# EAGLE design R122C (EAGLE 6.6.0)
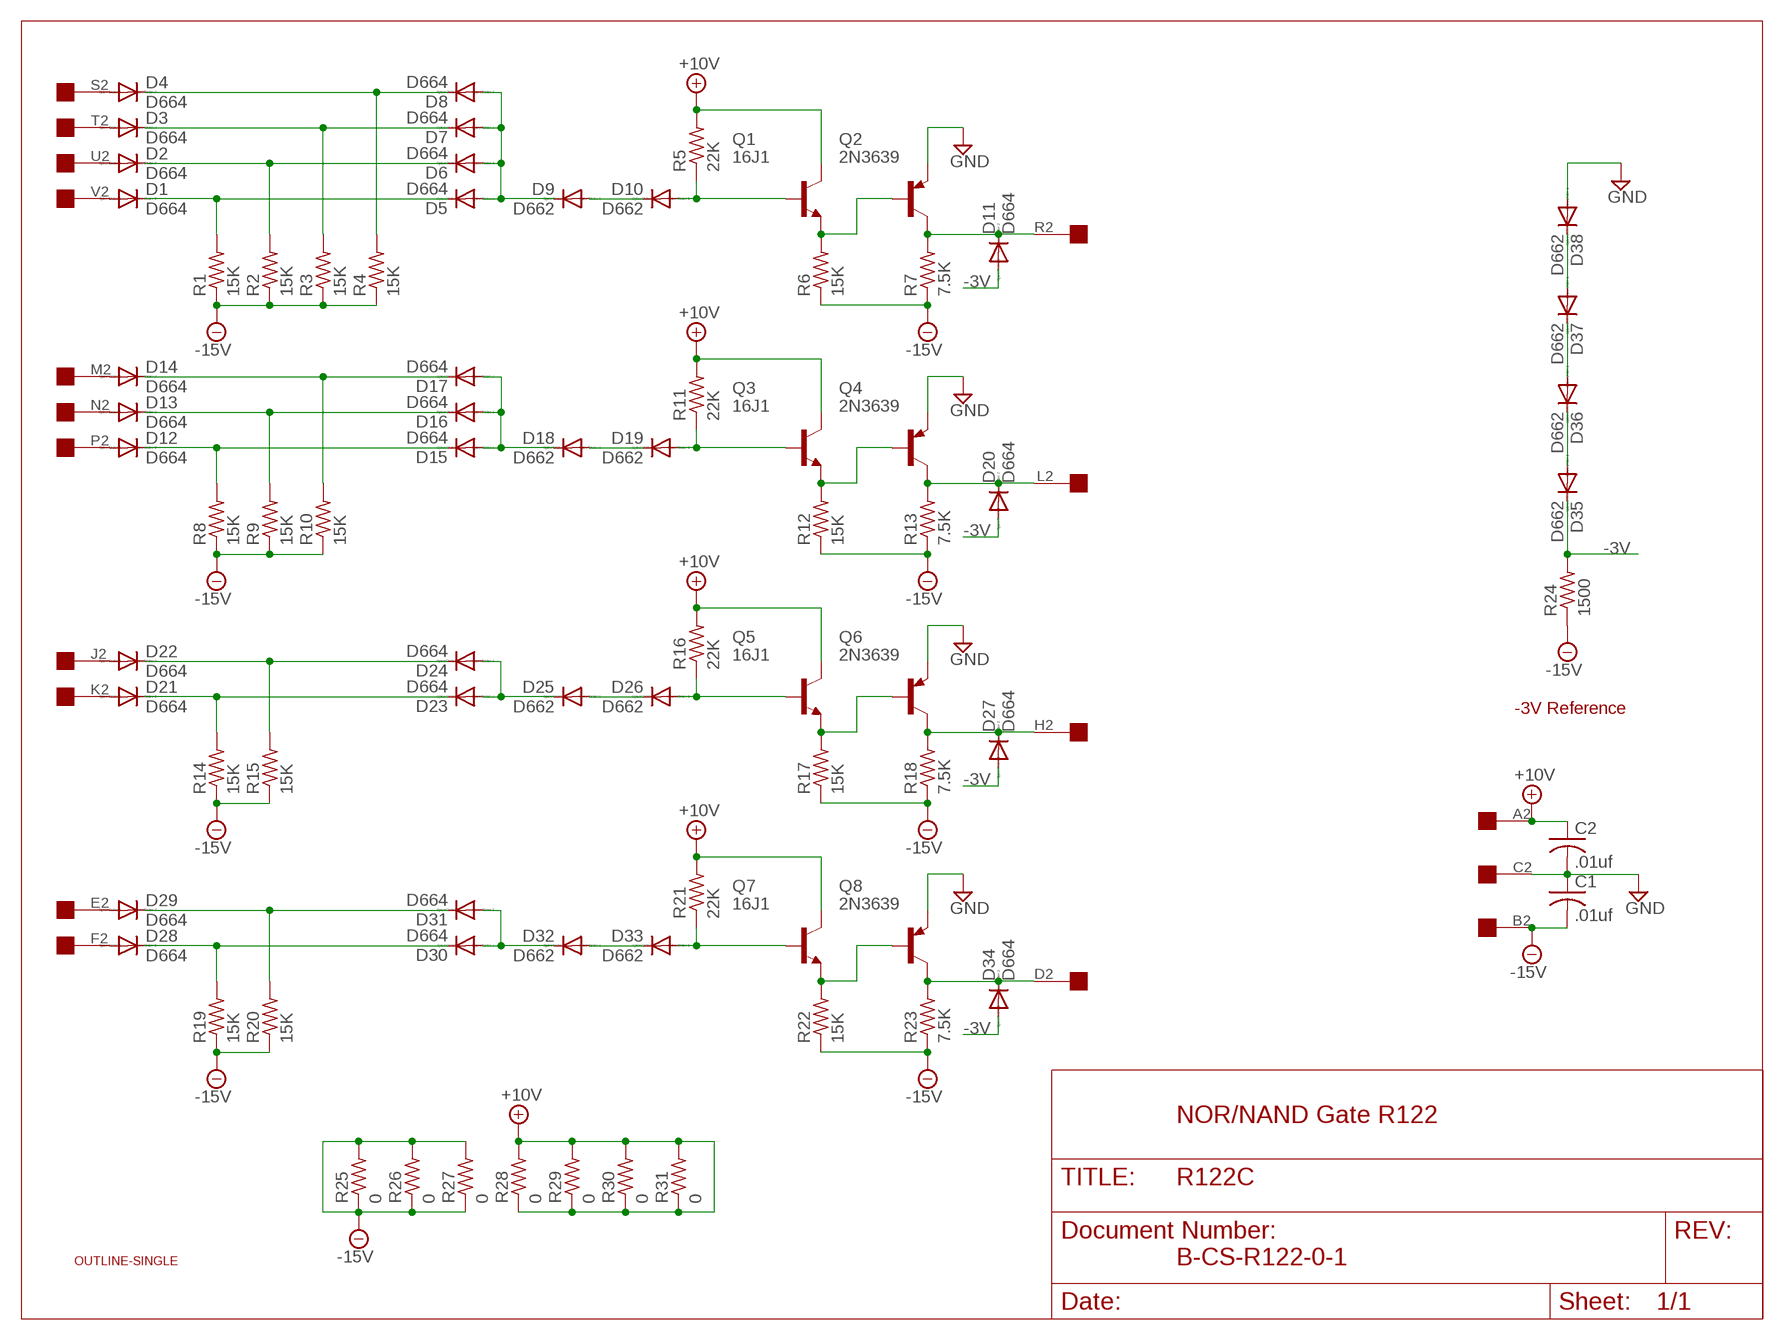
[diagram p0: schematic, sheet 1]

## Parts
C1  .01uf  C-US  [C063-025X075]
C2  .01uf  C-US  [C063-025X075]
D1  D664  1N4148DO35-10  [DO35-10]
D2  D664  1N4148DO35-10  [DO35-10]
D3  D664  1N4148DO35-10  [DO35-10]
D4  D664  1N4148DO35-10  [DO35-10]
D5  D664  1N4148DO35-10  [DO35-10]
D6  D664  1N4148DO35-10  [DO35-10]
D7  D664  1N4148DO35-10  [DO35-10]
D8  D664  1N4148DO35-10  [DO35-10]
D9  D662  1N4148DO35-10  [DO35-10]
D10  D662  1N4148DO35-10  [DO35-10]
D11  D664  1N4148DO35-10  [DO35-10]
D12  D664  1N4148DO35-10  [DO35-10]
D13  D664  1N4148DO35-10  [DO35-10]
D14  D664  1N4148DO35-10  [DO35-10]
D15  D664  1N4148DO35-10  [DO35-10]
D16  D664  1N4148DO35-10  [DO35-10]
D17  D664  1N4148DO35-10  [DO35-10]
D18  D662  1N4148DO35-10  [DO35-10]
D19  D662  1N4148DO35-10  [DO35-10]
D20  D664  1N4148DO35-10  [DO35-10]
D21  D664  1N4148DO35-10  [DO35-10]
D22  D664  1N4148DO35-10  [DO35-10]
D23  D664  1N4148DO35-10  [DO35-10]
D24  D664  1N4148DO35-10  [DO35-10]
D25  D662  1N4148DO35-10  [DO35-10]
D26  D662  1N4148DO35-10  [DO35-10]
D27  D664  1N4148DO35-10  [DO35-10]
D28  D664  1N4148DO35-10  [DO35-10]
D29  D664  1N4148DO35-10  [DO35-10]
D30  D664  1N4148DO35-10  [DO35-10]
D31  D664  1N4148DO35-10  [DO35-10]
D32  D662  1N4148DO35-10  [DO35-10]
D33  D662  1N4148DO35-10  [DO35-10]
D34  D664  1N4148DO35-10  [DO35-10]
D35  D662  1N4148DO35-10  [DO35-10]
D36  D662  1N4148DO35-10  [DO35-10]
D37  D662  1N4148DO35-10  [DO35-10]
D38  D662  1N4148DO35-10  [DO35-10]
Q1  16J1  2N1711-NPN-TO39-EBC  [TO39]
Q2  2N3639  2N3637  [TO39]
Q3  16J1  2N1711-NPN-TO39-EBC  [TO39]
Q4  2N3639  2N3637  [TO39]
Q5  16J1  2N1711-NPN-TO39-EBC  [TO39]
Q6  2N3639  2N3637  [TO39]
Q7  16J1  2N1711-NPN-TO39-EBC  [TO39]
Q8  2N3639  2N3637  [TO39]
R1  15K  R-US_0207/10  [0207/10]
R2  15K  R-US_0207/10  [0207/10]
R3  15K  R-US_0207/10  [0207/10]
R4  15K  R-US_0207/10  [0207/10]
R5  22K  R-US_0207/10  [0207/10]
R6  15K  R-US_0207/10  [0207/10]
R7  7.5K  R-US_0207/10  [0207/10]
R8  15K  R-US_0207/10  [0207/10]
R9  15K  R-US_0207/10  [0207/10]
R10  15K  R-US_0207/10  [0207/10]
R11  22K  R-US_0207/10  [0207/10]
R12  15K  R-US_0207/10  [0207/10]
R13  7.5K  R-US_0207/10  [0207/10]
R14  15K  R-US_0207/10  [0207/10]
R15  15K  R-US_0207/10  [0207/10]
R16  22K  R-US_0207/10  [0207/10]
R17  15K  R-US_0207/10  [0207/10]
R18  7.5K  R-US_0207/10  [0207/10]
R19  15K  R-US_0207/10  [0207/10]
R20  15K  R-US_0207/10  [0207/10]
R21  22K  R-US_0207/10  [0207/10]
R22  15K  R-US_0207/10  [0207/10]
R23  7.5K  R-US_0207/10  [0207/10]
R24  1500  R-US_0207/10  [0207/10]
R25  0  R-US_0207/10  [0207/10]
R26  0  R-US_0207/10  [0207/10]
R27  0  R-US_0207/10  [0207/10]
R28  0  R-US_0207/10  [0207/10]
R29  0  R-US_0207/10  [0207/10]
R30  0  R-US_0207/10  [0207/10]
R31  0  R-US_0207/10  [0207/10]
U$1  OUTLINE-SINGLE  [SINGLE]
U$2  EDGE-1  [EDGE-CON1]

## Nets
+10V [Power]: C2.1 Q1.3(C) Q3.3(C) Q5.3(C) Q7.3(C) R5.2 R11.2 R16.2 R21.2 R28.1 R28.2 R29.1 R29.2 R30.1 R30.2 R31.1 R31.2 U$2.A2
-3V [Power]: D11.A D20.A D27.A D34.A D35.C R24.2
-15V [Power]: C1.2 R1.1 R2.1 R3.1 R4.1 R6.1 R7.1 R8.1 R9.1 R10.1 R12.1 R13.1 R14.1 R15.1 R17.1 R18.1 R19.1 R20.1 R22.1 R23.1 R24.1 R25.1 R25.2 R26.1 R26.2 R27.1 R27.2 U$2.B2
GND [Power]: C1.1 C2.2 D38.A Q2.1(E) Q4.1(E) Q6.1(E) Q8.1(E) U$2.C2
N$1: D19.A Q3.2(B) R11.1
N$2: D14.A U$2.M2
N$3: D37.A D38.C
N$4: D12.C D15.C R8.2
N$5: D11.C Q2.3(C) R7.2 U$2.R2
N$6: D18.A D19.C
N$7: D13.A U$2.N2
N$8: D20.C Q4.3(C) R13.2 U$2.L2
N$9: D12.A U$2.P2
N$10: D21.A U$2.K2
N$11: D15.A D16.A D17.A D18.C
N$12: D22.A U$2.J2
N$13: D36.A D37.C
N$14: D14.C D17.C R10.2
N$15: D13.C D16.C R9.2
N$16: D35.A D36.C
N$17: Q3.1(E) Q4.2(B) R12.2
N$18: D26.A Q5.2(B) R16.1
N$19: D10.A Q1.2(B) R5.1
N$20: D4.A U$2.S2
N$21: D1.A U$2.V2
N$22: D1.C D5.C R1.2
N$23: D9.A D10.C
N$24: D28.A U$2.F2
N$25: D3.A U$2.T2
N$26: D21.C D23.C R14.2
N$27: D25.A D26.C
N$28: D29.A U$2.E2
N$29: D5.A D6.A D7.A D8.A D9.C
N$30: D4.C D8.C R4.2
N$31: D27.C Q6.3(C) R18.2 U$2.H2
N$32: D3.C D7.C R3.2
N$33: D2.C D6.C R2.2
N$34: Q1.1(E) Q2.2(B) R6.2
N$37: D23.A D24.A D25.C
N$39: D2.A U$2.U2
N$41: D22.C D24.C R15.2
N$42: Q5.1(E) Q6.2(B) R17.2
N$43: D33.A Q7.2(B) R21.1
N$45: D28.C D30.C R19.2
N$46: D32.A D33.C
N$48: D34.C Q8.3(C) R23.2 U$2.D2
N$51: D30.A D31.A D32.C
N$54: D29.C D31.C R20.2
N$55: Q7.1(E) Q8.2(B) R22.2

## Notes on the sheet
- -3V Reference
- NOR/NAND Gate R122
- B-CS-R122-0-1

## Library data of the parts
C1 C2 = dec-con:C-US: Capacitors with funky DEC lead spacing.
D1-D38 = diode:1N4148: DIODE high speed (Philips)
Q1 Q3 Q5 Q7 = transistor:*-NPN-: NPN Transistror BF959 corrected 2008.03.06
Q2 Q4 Q6 Q8 = transistor-pnp:2N3637*: PNP Transistror
R1-R31 = rcl:R-US_: RESISTOR, American symbol
U$1 = dec-con:OUTLINE-*: Board outlines for DEC boards.
U$2 = dec-con:EDGE-1: Single-Sided DEC Edge Connector -- (side 2)

## Net classes
1 Power: width 0.813 mm

## Board
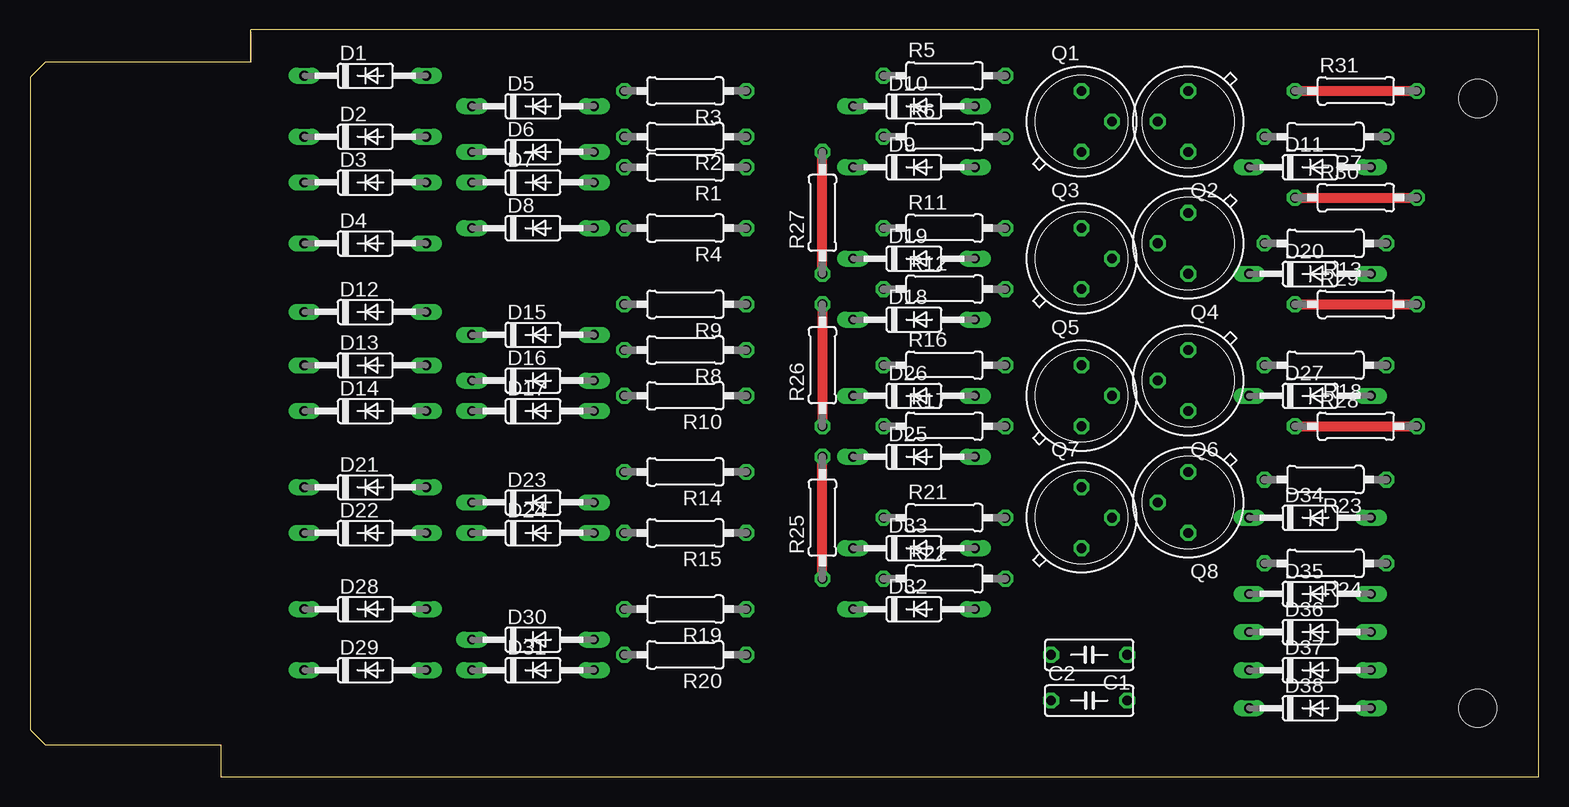
[diagram p1: board, top side]
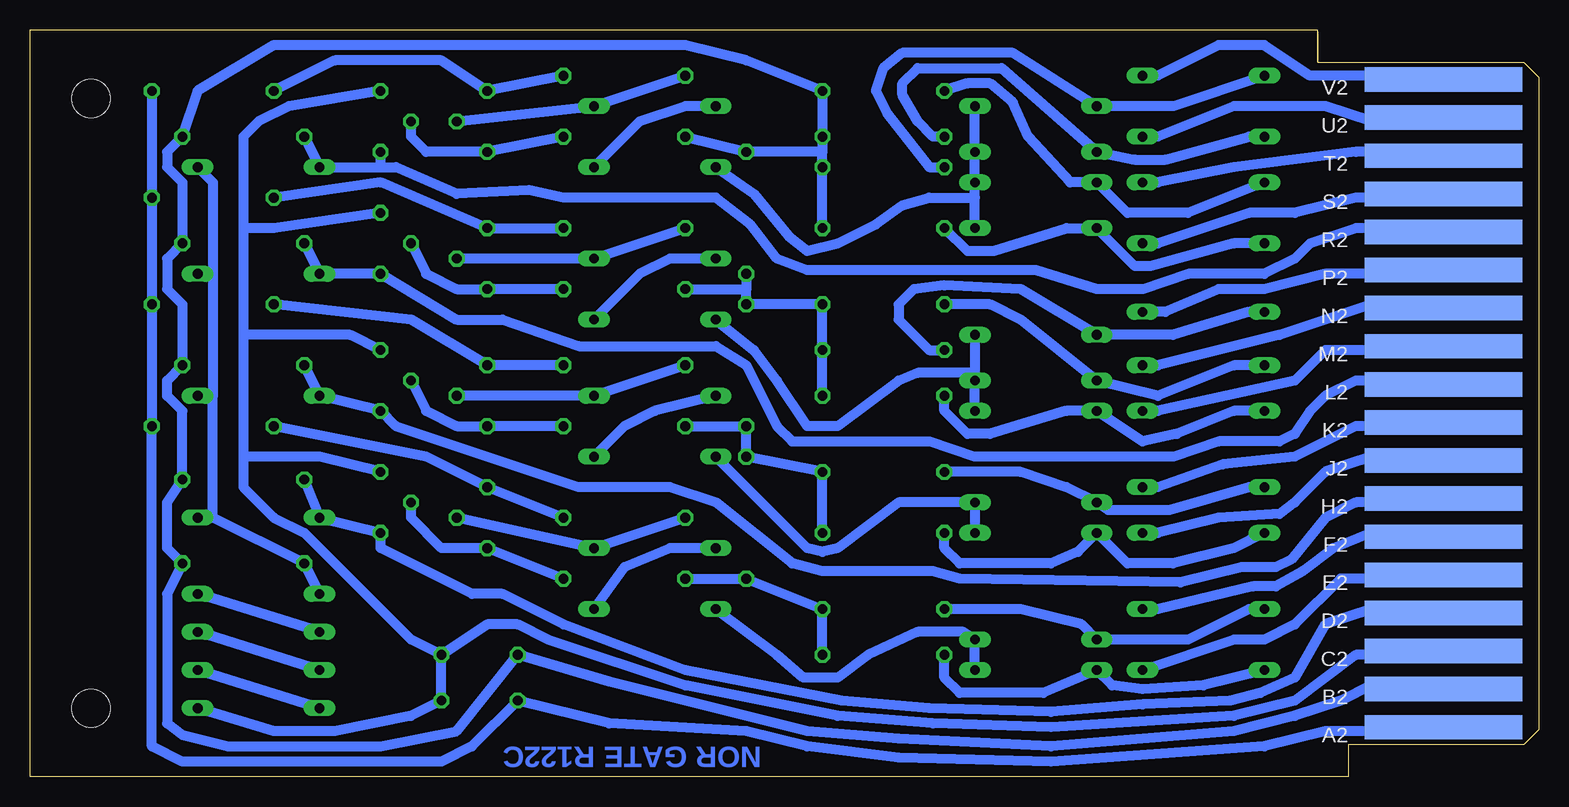
[diagram p2: board, bottom side, seen from below]

Size 125.73 x 62.23 mm. Coordinates in mm from the lower left corner, seen from the top.
Copper layers (1+16): Top 0.035mm / dielectric 1.5mm / Bottom 0.035mm
Design rules "16mils": minimum track width 16mil, minimum drill 32mil, track to track 15mil, track to pad 10mil, pad to pad 10mil, via to via 10mil, smd to smd 10mil, copper to edge 13mil, drill to drill 10mil, minimum pad ring 10mil, minimum via ring 8mil, stop-mask expansion 0mil, vias tented up to drill 0mil, thermal gap 10mil

### Footprints (pad centres in the part's own frame; a part is rotated, then mirrored left to right if it is on the bottom)
C063-025X075 = drill 0.813 octagon: 1 -2.54,0; 2 3.81,0
DO35-10 = drill 0.813 long: A 5.08,0; C -5.08,0
TO39 = drill 0.813 octagon: 1 0,-2.54; 2 2.54,0; 3 0,2.54
0207/10 = drill 0.813 octagon: 1 -5.08,0; 2 5.08,0
SINGLE = hole 3.175: 120.65,56.515; 120.65,5.715
EDGE-CON1 = smd 13.106 x 2.032 bottom: A2 7.938,4.128; B2 7.938,7.303; C2 7.938,10.477; D2 7.938,13.652; E2 7.938,16.828; F2 7.938,20.003; H2 7.938,23.177; J2 7.938,26.352; K2 7.938,29.527; L2 7.938,32.703; M2 7.938,35.877; N2 7.938,39.053; P2 7.938,42.227; R2 7.938,45.403; S2 7.938,48.578; T2 7.938,51.752; U2 7.938,54.928; V2 7.938,58.102

### Placement (x,y rotation side)
C1  88.9,10.16 180 top
C2  87.63,6.35 0 top
D1  27.94,58.42 0 top
D2  27.94,53.34 0 top
D3  27.94,49.53 0 top
D4  27.94,44.45 0 top
D5  41.91,55.88 0 top
D6  41.91,52.07 0 top
D7  41.91,49.53 0 top
D8  41.91,45.72 0 top
D9  73.66,50.8 0 top
D10  73.66,55.88 0 top
D11  106.68,50.8 0 top
D12  27.94,38.73 0 top
D13  27.94,34.29 0 top
D14  27.94,30.48 0 top
D15  41.91,36.83 0 top
D16  41.91,33.02 0 top
D17  41.91,30.48 0 top
D18  73.66,38.1 0 top
D19  73.66,43.18 0 top
D20  106.68,41.91 0 top
D21  27.94,24.13 0 top
D22  27.94,20.32 0 top
D23  41.91,22.86 0 top
D24  41.91,20.32 0 top
D25  73.66,26.67 0 top
D26  73.66,31.75 0 top
D27  106.68,31.75 0 top
D28  27.94,13.97 0 top
D29  27.94,8.89 0 top
D30  41.91,11.43 0 top
D31  41.91,8.89 0 top
D32  73.66,13.97 0 top
D33  73.66,19.05 0 top
D34  106.68,21.59 0 top
D35  106.68,15.24 0 top
D36  106.68,12.06 0 top
D37  106.68,8.89 0 top
D38  106.68,5.71 0 top
Q1  87.63,54.61 0 top
Q2  96.52,54.61 180 top
Q3  87.63,43.18 0 top
Q4  96.52,44.45 180 top
Q5  87.63,31.75 0 top
Q6  96.52,33.02 180 top
Q7  87.63,21.59 0 top
Q8  96.52,22.86 180 top
R1  54.61,50.8 180 top
R2  54.61,53.34 180 top
R3  54.61,57.15 180 top
R4  54.61,45.72 180 top
R5  76.2,58.42 0 top
R6  76.2,53.34 0 top
R7  107.95,53.34 180 top
R8  54.61,35.56 180 top
R9  54.61,39.37 180 top
R10  54.61,31.75 180 top
R11  76.2,45.72 0 top
R12  76.2,40.64 0 top
R13  107.95,44.45 180 top
R14  54.61,25.4 180 top
R15  54.61,20.32 180 top
R16  76.2,34.29 0 top
R17  76.2,29.21 0 top
R18  107.95,34.29 180 top
R19  54.61,13.97 180 top
R20  54.61,10.16 180 top
R21  76.2,21.59 0 top
R22  76.2,16.51 0 top
R23  107.95,24.77 180 top
R24  107.95,17.78 180 top
R25  66.04,21.59 90 top
R26  66.04,34.29 90 top
R27  66.04,46.99 90 top
R28  110.49,29.21 0 top
R29  110.49,39.37 0 top
R30  110.49,48.26 0 top
R31  110.49,57.15 0 top
U$1  0,0 0 top
U$2  0,0 0 top

### Tracks (layer width: path | path; a pad name or v marks a point on that pad's centre or on a via)
+10V
  Top 0.813: R31.1 R31.2 | R30.1 R30.2 | R28.1 R28.2 | R29.1 R29.2
  Bottom 0.813: U$2.A2 8.89,4.13 8.89,3.81 17.78,3.81 22.86,2.54 40.64,1.27 53.34,1.59 60.96,2.54 66.04,3.81 77.47,4.45 C2.1 88.9,2.54 91.44,1.27 113.03,1.27 115.57,2.54 R28.2 R29.2 R30.2 R31.2 | R5.2 Q1.3 91.44,59.69 100.33,59.69 R31.1 | R21.2 Q7.3 92.71,26.67 R28.1 | R16.2 Q5.3 93.98,38.1 R29.1 | R30.1 96.52,49.53 Q3.3 R11.2
-3V
  Bottom 0.813: D35.C R24.2 110.49,21.59 | D34.A 110.49,21.59 | 110.49,21.59 110.49,31.75 | D27.A 110.49,31.75 | D20.A 110.49,41.91 | 110.49,41.91 110.49,31.75 | D11.A 110.49,49.53 110.49,41.91
-15V
  Top 0.813: R27.1 R27.2 | R26.2 R26.1 | R25.1 R25.2
  Bottom 0.813: U$2.B2 8.89,7.62 13.97,7.62 16.51,6.35 20.32,5.08 25.4,3.81 40.64,2.54 53.34,3.17 60.96,3.81 77.47,7.94 C1.2 90.17,3.81 96.52,2.54 109.22,2.54 113.03,3.49 114.3,4.45 114.3,15.24 R24.1 114.3,19.05 114.3,22.86 R23.1 113.03,30.48 114.3,31.75 114.3,33.02 R18.1 113.03,39.37 114.3,40.64 114.3,43.18 R13.1 113.03,49.53 114.3,50.8 114.3,52.07 R7.1 111.76,57.15 105.41,60.96 71.12,60.96 66.04,59.69 R3.1 R2.1 59.69,52.07 | R10.1 R8.1 R9.1 R26.2 66.04,40.64 | R15.1 R14.1 R25.2 R26.1 R17.1 | R20.1 R19.1 R25.1 R22.1 | 59.69,52.07 R1.1 R4.1 | R27.1 66.04,40.64 | R12.1 66.04,40.64 | 59.69,52.07 R27.2 R6.1
GND
  Bottom 0.813: U$2.C2 8.89,10.16 15.24,10.16 20.32,6.35 25.4,5.08 40.64,4.13 50.48,4.45 58.42,5.08 71.12,7.62 82.55,11.43 85.09,12.7 87.63,12.7 C1.1 | C1.1 C2.2 93.98,5.08 100.33,3.81 105.41,3.81 D38.A | C1.1 93.98,11.43 102.87,20.32 105.41,21.59 107.95,24.13 107.95,26.67 | Q8.1 101.6,26.67 107.95,26.67 | Q2.1 104.14,55.88 106.68,54.61 107.95,53.34 107.95,45.72 | 107.95,45.72 107.95,36.83 | 107.95,36.83 107.95,26.67 | Q6.1 99.06,36.83 107.95,36.83 | Q4.1 105.41,45.72 107.95,45.72
N$1
  Bottom 0.813: R11.1 D19.A Q3.2
N$2
  Bottom 0.813: U$2.M2 8.89,35.56 17.78,35.56 20.32,33.02 31.75,30.48 D14.A
N$3
  Bottom 0.813: D38.C D37.A
N$4
  Bottom 0.813: D12.C 24.13,38.73 30.48,36.83 D15.C 43.18,40.64 49.53,40.96 52.07,40.64 53.34,39.37 53.34,38.1 50.8,35.56 R8.2
N$5
  Bottom 0.813: U$2.R2 8.89,45.72 15.24,45.72 19.05,44.45 20.32,43.18 22.86,41.91 29.21,41.91 33.02,40.64 36.83,40.64 41.91,42.23 60.96,42.23 63.5,43.18 65.72,46.04 68.58,48.26 81.28,48.26 84.14,48.9 90.17,48.58 95.25,50.8 96.52,50.8 | 96.52,50.8 Q2.3 | 96.52,50.8 D11.C R7.2
N$6
  Bottom 0.813: D19.C 72.39,43.18 74.93,41.91 D18.A
N$7
  Bottom 0.813: U$2.N2 8.89,39.37 13.97,39.37 21.59,36.83 31.75,34.29 D13.A
N$8
  Bottom 0.813: U$2.L2 8.89,33.02 15.24,33.02 17.78,31.75 19.05,30.48 20.32,28.57 21.59,27.94 26.67,27.94 30.48,26.67 46.99,26.67 50.8,27.94 62.23,27.94 63.5,29.21 66.04,34.29 68.58,35.88 80.01,35.88 86.36,38.1 90.17,38.1 Q4.3 D20.C R13.2
N$9
  Bottom 0.813: U$2.P2 8.89,41.91 17.78,41.91 22.86,40.64 26.67,40.64 31.12,38.73 D12.A
N$10
  Bottom 0.813: U$2.K2 8.89,29.21 15.24,29.21 20.32,26.67 26.35,26.04 31.75,24.13 D21.A
N$11
  Bottom 0.813: D15.A 46.99,33.66 | 46.99,33.66 D16.A D17.A | 46.99,33.66 51.75,33.66 53.34,33.02 58.42,29.21 60.96,29.21 63.5,33.02 65.41,35.56 D18.C
N$12
  Bottom 0.813: U$2.J2 10.16,26.67 13.97,26.67 17.78,25.4 20.32,22.86 21.59,21.91 26.67,21.59 31.75,20.32 D22.A
N$13
  Bottom 0.813: D37.C D36.A
N$14
  Bottom 0.813: D14.C 25.4,30.48 30.16,28.57 33.02,27.94 D17.C 39.37,30.48 45.72,28.57 47.63,28.57 49.53,30.48 R10.2
N$15
  Bottom 0.813: D13.C 25.4,34.29 31.75,31.75 D16.C 43.18,38.1 45.72,39.37 R9.2
N$16
  Bottom 0.813: D36.C D35.A
N$17
  Bottom 0.813: R12.2 Q3.1 90.17,40.64 92.71,41.91 Q4.2
N$18
  Bottom 0.813: R16.1 D26.A Q5.2
N$19
  Bottom 0.813: R5.1 D10.A Q1.2
N$20
  Bottom 0.813: U$2.S2 8.89,48.26 15.24,48.26 20.32,46.99 24.13,46.99 31.75,44.45 D4.A
N$21
  Bottom 0.813: U$2.V2 10.16,58.42 19.05,58.42 22.86,60.96 26.67,60.96 31.75,58.42 D1.A
N$22
  Bottom 0.813: D1.C 30.48,55.88 D5.C 43.82,60.33 53.02,60.33 54.61,59.05 55.25,57.15 54.29,55.24 50.8,50.8 R1.2
N$23
  Bottom 0.813: D10.C 71.12,55.88 74.93,54.61 D9.A
N$24
  Bottom 0.813: U$2.F2 7.62,20.32 13.97,20.32 17.15,19.05 19.69,17.14 21.91,15.88 23.81,15.88 31.75,13.97 D28.A
N$25
  Bottom 0.813: U$2.T2 8.89,52.07 15.24,52.07 25.4,50.8 31.75,49.53 D3.A
N$26
  Bottom 0.813: D21.C 24.13,24.13 30.8,22.23 35.88,22.23 D23.C 39.37,24.13 43.18,25.4 R14.2
N$27
  Bottom 0.813: D26.C 73.66,30.48 76.2,29.21 D25.A
N$28
  Bottom 0.813: U$2.E2 8.89,16.51 16.51,16.51 20.32,12.7 22.86,11.43 25.4,11.43 D29.A
N$29
  Bottom 0.813: D8.A 46.99,48.26 | 46.99,48.26 D7.A D6.A D5.A | D9.C 65.41,48.58 62.55,45.09 60.96,43.81 58.42,44.45 55.25,46.04 53.02,47.62 50.8,48.26 46.99,48.26
N$30
  Bottom 0.813: D4.C 25.4,44.45 32.39,42.55 33.66,42.55 D8.C 39.37,45.72 45.4,43.81 47.63,43.81 R4.2
N$31
  Bottom 0.813: U$2.H2 8.89,22.86 15.24,22.86 17.78,21.59 20.64,18.1 21.91,17.46 24.77,17.46 29.85,16.19 48.26,16.51 50.48,17.14 59.69,17.14 62.23,17.78 68.58,22.86 72.39,24.13 80.01,24.13 95.25,29.21 Q6.3 D27.C R18.2
N$32
  Bottom 0.813: D3.C 29.21,46.99 34.29,46.99 D7.C 39.05,49.53 42.55,53.34 43.82,56.2 45.72,57.78 47.63,57.78 R3.2
N$33
  Bottom 0.813: D2.C 24.13,53.34 31.12,51.44 33.66,51.44 D6.C 44.77,59.05 51.75,59.05 53.02,57.78 53.02,56.83 51.75,54.61 50.48,53.34 R2.2
N$34
  Bottom 0.813: R6.2 Q1.1 92.71,52.07 93.98,53.34 Q2.2
N$37
  Bottom 0.813: D24.A D23.A 53.34,22.86 58.42,19.05 59.69,18.73 60.96,19.05 D25.C
N$39
  Bottom 0.813: U$2.U2 8.89,54.61 13.97,54.61 17.78,55.88 25.4,55.88 31.75,53.34 D2.A
N$41
  Bottom 0.813: D22.C 25.4,19.05 30.48,17.78 34.29,17.78 D24.C 38.42,18.73 40.64,17.78 48.26,17.78 49.53,19.05 R15.2
N$42
  Bottom 0.813: R17.2 Q5.1 90.17,29.21 92.71,30.48 Q6.2
N$43
  Bottom 0.813: R21.1 D33.A Q7.2
N$45
  Bottom 0.813: D28.C 24.13,13.97 29.21,11.43 D30.C 38.1,12.7 43.18,13.97 R19.2
N$46
  Bottom 0.813: D33.C 72.39,19.05 76.2,17.46 D32.A
N$48
  Bottom 0.813: U$2.D2 8.89,13.97 13.97,13.97 17.78,12.7 20.32,8.26 23.18,6.99 25.72,6.35 33.02,6.03 40.64,5.4 50.8,5.71 58.1,6.35 71.12,8.89 81.28,12.7 86.36,15.24 88.9,15.24 96.52,19.05 Q8.3 D34.C R23.2
N$51
  Bottom 0.813: D31.A D30.A 47.94,12.06 51.75,12.06 55.88,10.16 58.42,8.26 61.28,8.26 63.5,10.16 D32.C
N$54
  Bottom 0.813: D29.C 27.94,7.62 33.02,7.3 35.56,7.62 D31.C 41.28,6.99 48.26,6.99 49.53,8.26 R20.2
N$55
  Bottom 0.813: R22.2 Q7.1 91.44,19.05 93.98,21.59 Q8.2

### Text on the board
Bottom: NOR GATE R122C
200bmp: C:/Users/Vince/Documents/eagle/projects/DEC/Rxxx/R122/R122Cbackfb.bmp